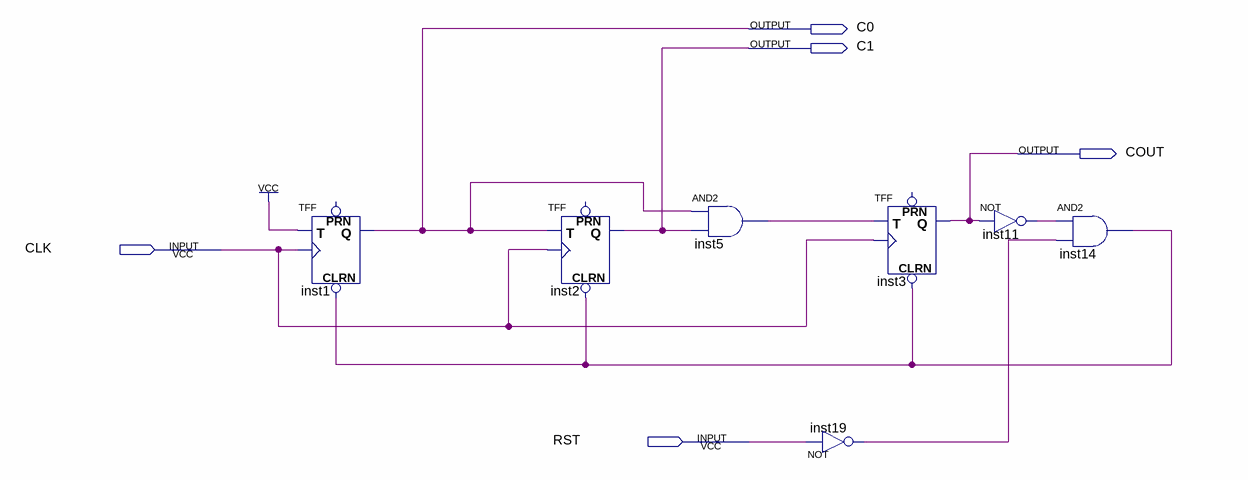
[diagram p0: schematic sheet]
// Quartus schematic counter_mod4.bdf as structural Verilog: 7 symbols, 5 pins
module counter_mod4 (
  input  CLK,
  input  RST,
  output C0,
  output C1,
  output COUT
);

  wire inst5_out, inst11_out, inst14_out, inst19_out;

  TFF inst1 (.CLRN(inst14_out), .T(1'b1), .CLK(CLK), .Q(C0));  // open: PRN
  TFF inst2 (.CLRN(inst14_out), .T(C0), .CLK(CLK), .Q(C1));  // open: PRN
  and inst5 (inst5_out, C0, C1);
  not inst19 (inst19_out, RST);
  TFF inst3 (.CLRN(inst14_out), .T(inst5_out), .CLK(CLK), .Q(COUT));  // open: PRN
  not inst11 (inst11_out, COUT);
  and inst14 (inst14_out, inst11_out, inst19_out);
endmodule
